# Altium schematic sheet protel_lowlevel_shield.SchDoc
size A4
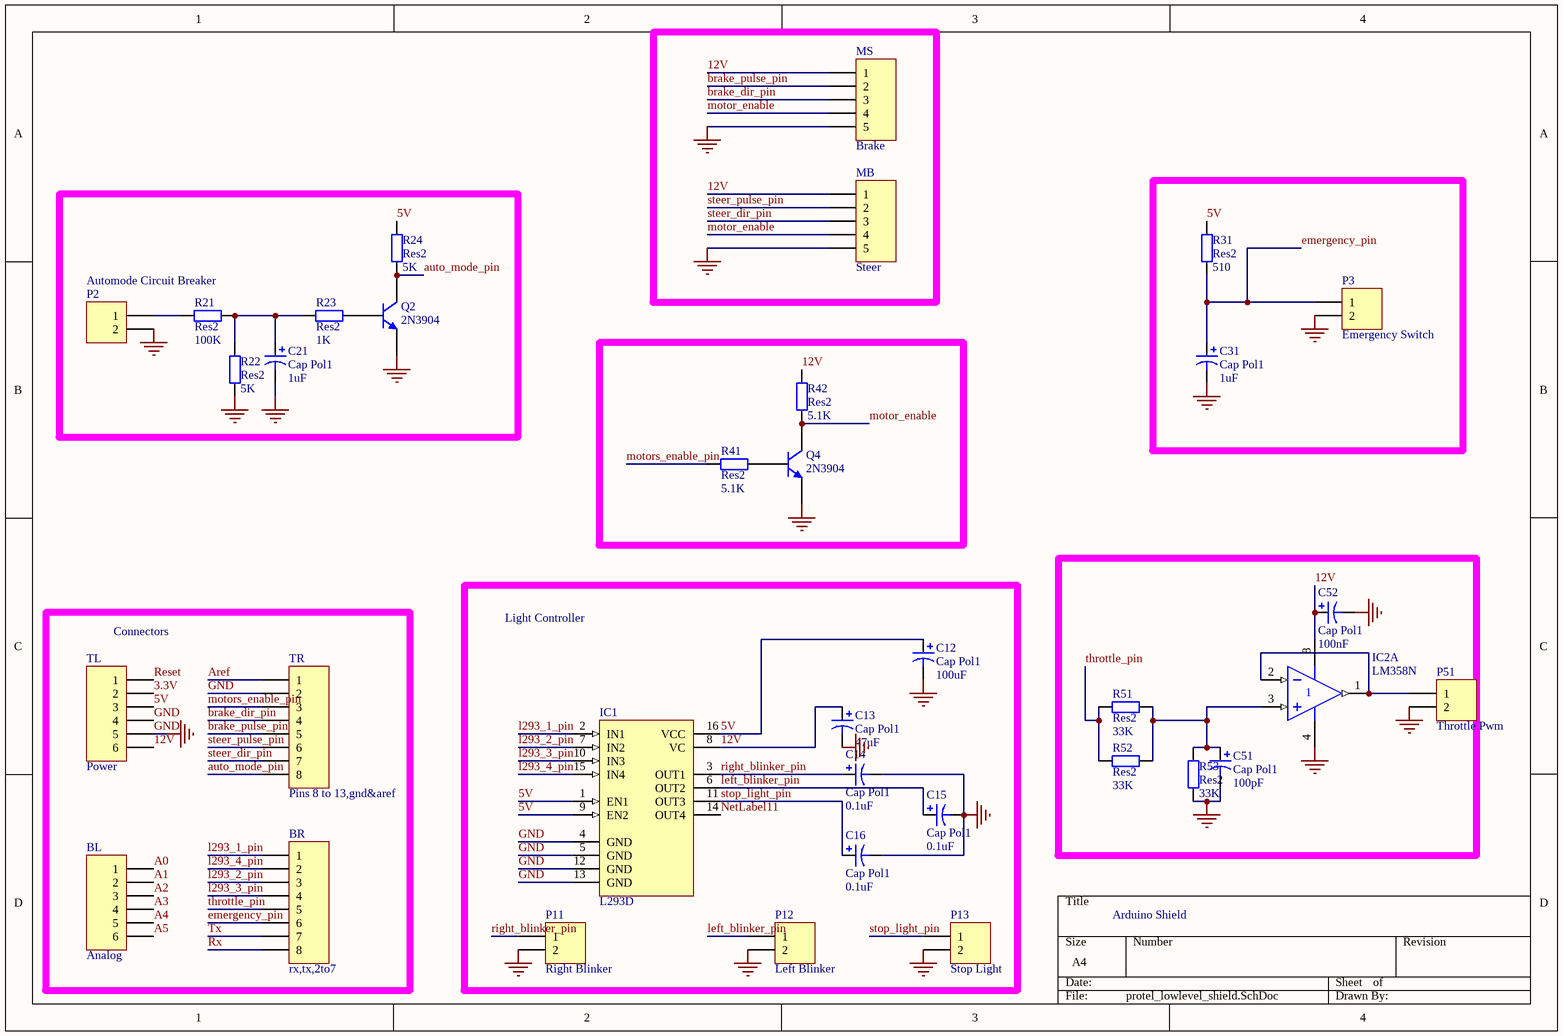
[diagram p0: protel_lowlevel_shield.SchDoc]

## Parts
BL  Analog  [HDR1X6]
BR  rx,tx,2to7  [HDR1X8]
C12  Cap Pol1  value 100uF  [CAPPR5-5x5]
C13  Cap Pol1  value 47uF  [CAPPR5-5x5]
C14  Cap Pol1  value 0.1uF  [CAPPR5-5x5]
C15  Cap Pol1  value 0.1uF  [CAPPR5-5x5]
C16  Cap Pol1  value 0.1uF  [CAPPR5-5x5]
C21  Cap Pol1  value 1uF  [CAPPR5-5x5]
C31  Cap Pol1  value 1uF  [CAPPR5-5x5]
C51  Cap Pol1  value 100pF  [CAPPR5-5x5]
C52  Cap Pol1  value 100nF  [CAPPR5-5x5]
IC1  L293D  [DIP16]
IC2  LM358N  [626-05]  (part A of 2)
MB  Steer  [HDR1X5H]
MS  Brake  [HDR1X5H]
P2  Automode Circuit Breaker  [HDR1X2]
P3  Emergency Switch  [HDR1X2]
P11  Right Blinker  [HDR1X2]
P12  Left Blinker  [HDR1X2]
P13  Stop Light  [HDR1X2]
P51  Throttle Pwm  [HDR1X2]
Q2  2N3904  [CAN-3/Y1.5]
Q4  2N3904  [CAN-3/D5.9]
R21  Res2  value 100K  [AXIAL-0.4]
R22  Res2  value 5K  [AXIAL-0.4]
R23  Res2  value 1K  [AXIAL-0.4]
R24  Res2  value 5K  [AXIAL-0.4]
R31  Res2  value 510  [AXIAL-0.4]
R41  Res2  value 5.1K  [AXIAL-0.4]
R42  Res2  value 5.1K  [AXIAL-0.4]
R51  Res2  value 33K  [AXIAL-0.4]
R52  Res2  value 33K  [AXIAL-0.4]
R53  Res2  value 33K  [AXIAL-0.4]
TL  Power  [HDR1X6]
TR  Pins 8 to 13,gnd&aref  [HDR1X8]

## Blocks framed on the sheet
Connectors: BL BR TL TR
Light Controller: C12-C16 IC1 P11-P13

## Nets
GND: C12.2 C13.2 C14.2 C15.2 C16.2 C21.2 C31.2 C51.2 C52.2 IC1.4(GND) IC1.5(GND) IC1.12(GND) IC1.13(GND) IC2.4(V-) MB.5 MS.5 P2.2 P3.2 P11.2 P12.2 P13.2 P51.2 Q2.1(E) Q4.1(E) R22.1 R53.1 TL.4 TL.5 TR.2
3.3V: TL.2
5V: C12.1 IC1.1(EN1) IC1.9(EN2) IC1.16(VCC) R24.2 R31.2 TL.3
12V: C13.1 C52.1 IC1.8(VC) IC2.8(V+) MB.1 MS.1 R42.2 TL.6
A0: BL.1
A1: BL.2
A2: BL.3
A3: BL.4
A4: BL.5
A5: BL.6
Aref: TR.1
auto_mode_pin: Q2.3(C) R24.1 TR.8
brake_dir_pin: MS.3 TR.4
brake_pulse_pin: MS.2 TR.5
emergency_pin: BR.6 C31.1 P3.1 R31.1
l293_1_pin: BR.1 IC1.2(IN1)
l293_2_pin: BR.3 IC1.7(IN2)
l293_3_pin: BR.4 IC1.10(IN3)
l293_4_pin: BR.2 IC1.15(IN4)
left_blinker_pin: C15.1 IC1.6(OUT2) P12.1
motor_enable: MB.4 MS.4 Q4.3(C) R42.1
motors_enable_pin: R41.1 TR.3
NetLabel11: IC1.14(OUT4)
Reset: TL.1
right_blinker_pin: C14.1 IC1.3(OUT1) P11.1
Rx: BR.8
steer_dir_pin: MB.3 TR.7
steer_pulse_pin: MB.2 TR.6
stop_light_pin: C16.1 IC1.11(OUT3) P13.1
throttle_pin: BR.5 R51.1 R52.1
Tx: BR.7
NetC21_1: C21.1 R21.2 R22.2 R23.1
NetC51_1: C51.1 IC2.3(IN+) R51.2 R52.2 R53.2
NetIC2_1: IC2.1(OUT) IC2.2(IN-) P51.1
NetP2_1: P2.1 R21.1
NetQ2_2: Q2.2(B) R23.2
NetQ4_2: Q4.2(B) R41.2

## Notes on the sheet
- Arduino Shield

## Library data of the parts
BL TL = Header 6H: Header, 6-Pin, Right Angle; LatestRevisionDate: 17-Jul-2002; LatestRevisionNote: Re-released for DXP Platform.; Publisher: Altium Limited
BR TR = Header 8H: Header, 8-Pin, Right Angle; LatestRevisionDate: 17-Jul-2002; LatestRevisionNote: Re-released for DXP Platform.; Publisher: Altium Limited
C12-C16 C21 C31 C51 C52 = Cap Pol1: Polarized Capacitor (Radial); Published: 8-Jun-2000; LatestRevisionDate: 17-Jul-2002; LatestRevisionNote: Re-released for DXP Platform.; Publisher: Altium Limited
IC1 = L293D: Push-Pull Four Channel Driver With Diode; Published: 8-Jun-2000; LatestRevisionDate: 6-Jun-2005; LatestRevisionNote: Stylized 3D Model Added.; DatasheetDocument: Jun-1996; PackageDocument: Apr-1996; PackageReference: DIP16; Publisher: Altium Limited; ComponentLink1Description: Manufacturer Link; ComponentLink1URL: http://www.st.com/; ComponentLink2Description: Datasheet; ComponentLink2URL: http://www.st.com/stonline/products/literature/ds/1330/l293d.pdf
IC2 = LM358N: Dual Low-Power Operational Amplifier; Published: 17-Jul-2002; DatasheetDocument: 1988; PackageReference: 626-05; Publisher: Altium Limited
MB MS = Header 5H: Header, 5-Pin, Right Angle; LatestRevisionDate: 17-Jul-2002; LatestRevisionNote: Re-released for DXP Platform.; Publisher: Altium Limited
P2 P3 P11-P13 P51 = Header 2: Header, 2-Pin; LatestRevisionDate: 17-Jul-2002; LatestRevisionNote: Re-released for DXP Platform.; Publisher: Altium Limited
Q2 Q4 = 2N2222: General Purpose Transistor NPN Silicon; Published: 29-Sep-2000; LatestRevisionDate: 17-Jul-2002; LatestRevisionNote: Re-released for DXP Platform.; DatasheetVersion: 1991; PackageVersion: 1997; PackageReference: 22-03; Publisher: Altium Limited; PackageDescription: Can; 3 Leads; Pin Circle Dia. 2.54 mm; Lead Dia. 0.48 mm (max); ComponentLink1Description: Manufacturer Link; ComponentLink1URL: http://www.onsemi.com/site/products/landing?taxonomyID=194
R21-R24 R31 R41 R42 R51-R53 = Res2: Resistor; Published: 8-Jun-2000; LatestRevisionDate: 17-Jul-2002; LatestRevisionNote: Re-released for DXP Platform.; Publisher: Altium Limited